# Altium schematic sheet 2.SchDoc
size A3; Author: Sofian Jafar; Engineer: Sofian Jafar; DocumentNumber: 2; Revision: 1.0; SheetNumber: 2; SheetTotal: 3; Descripition: UltraSound BBB Cape; SheetDescription: Band-Pass Filter, Envelope Detector and ADC
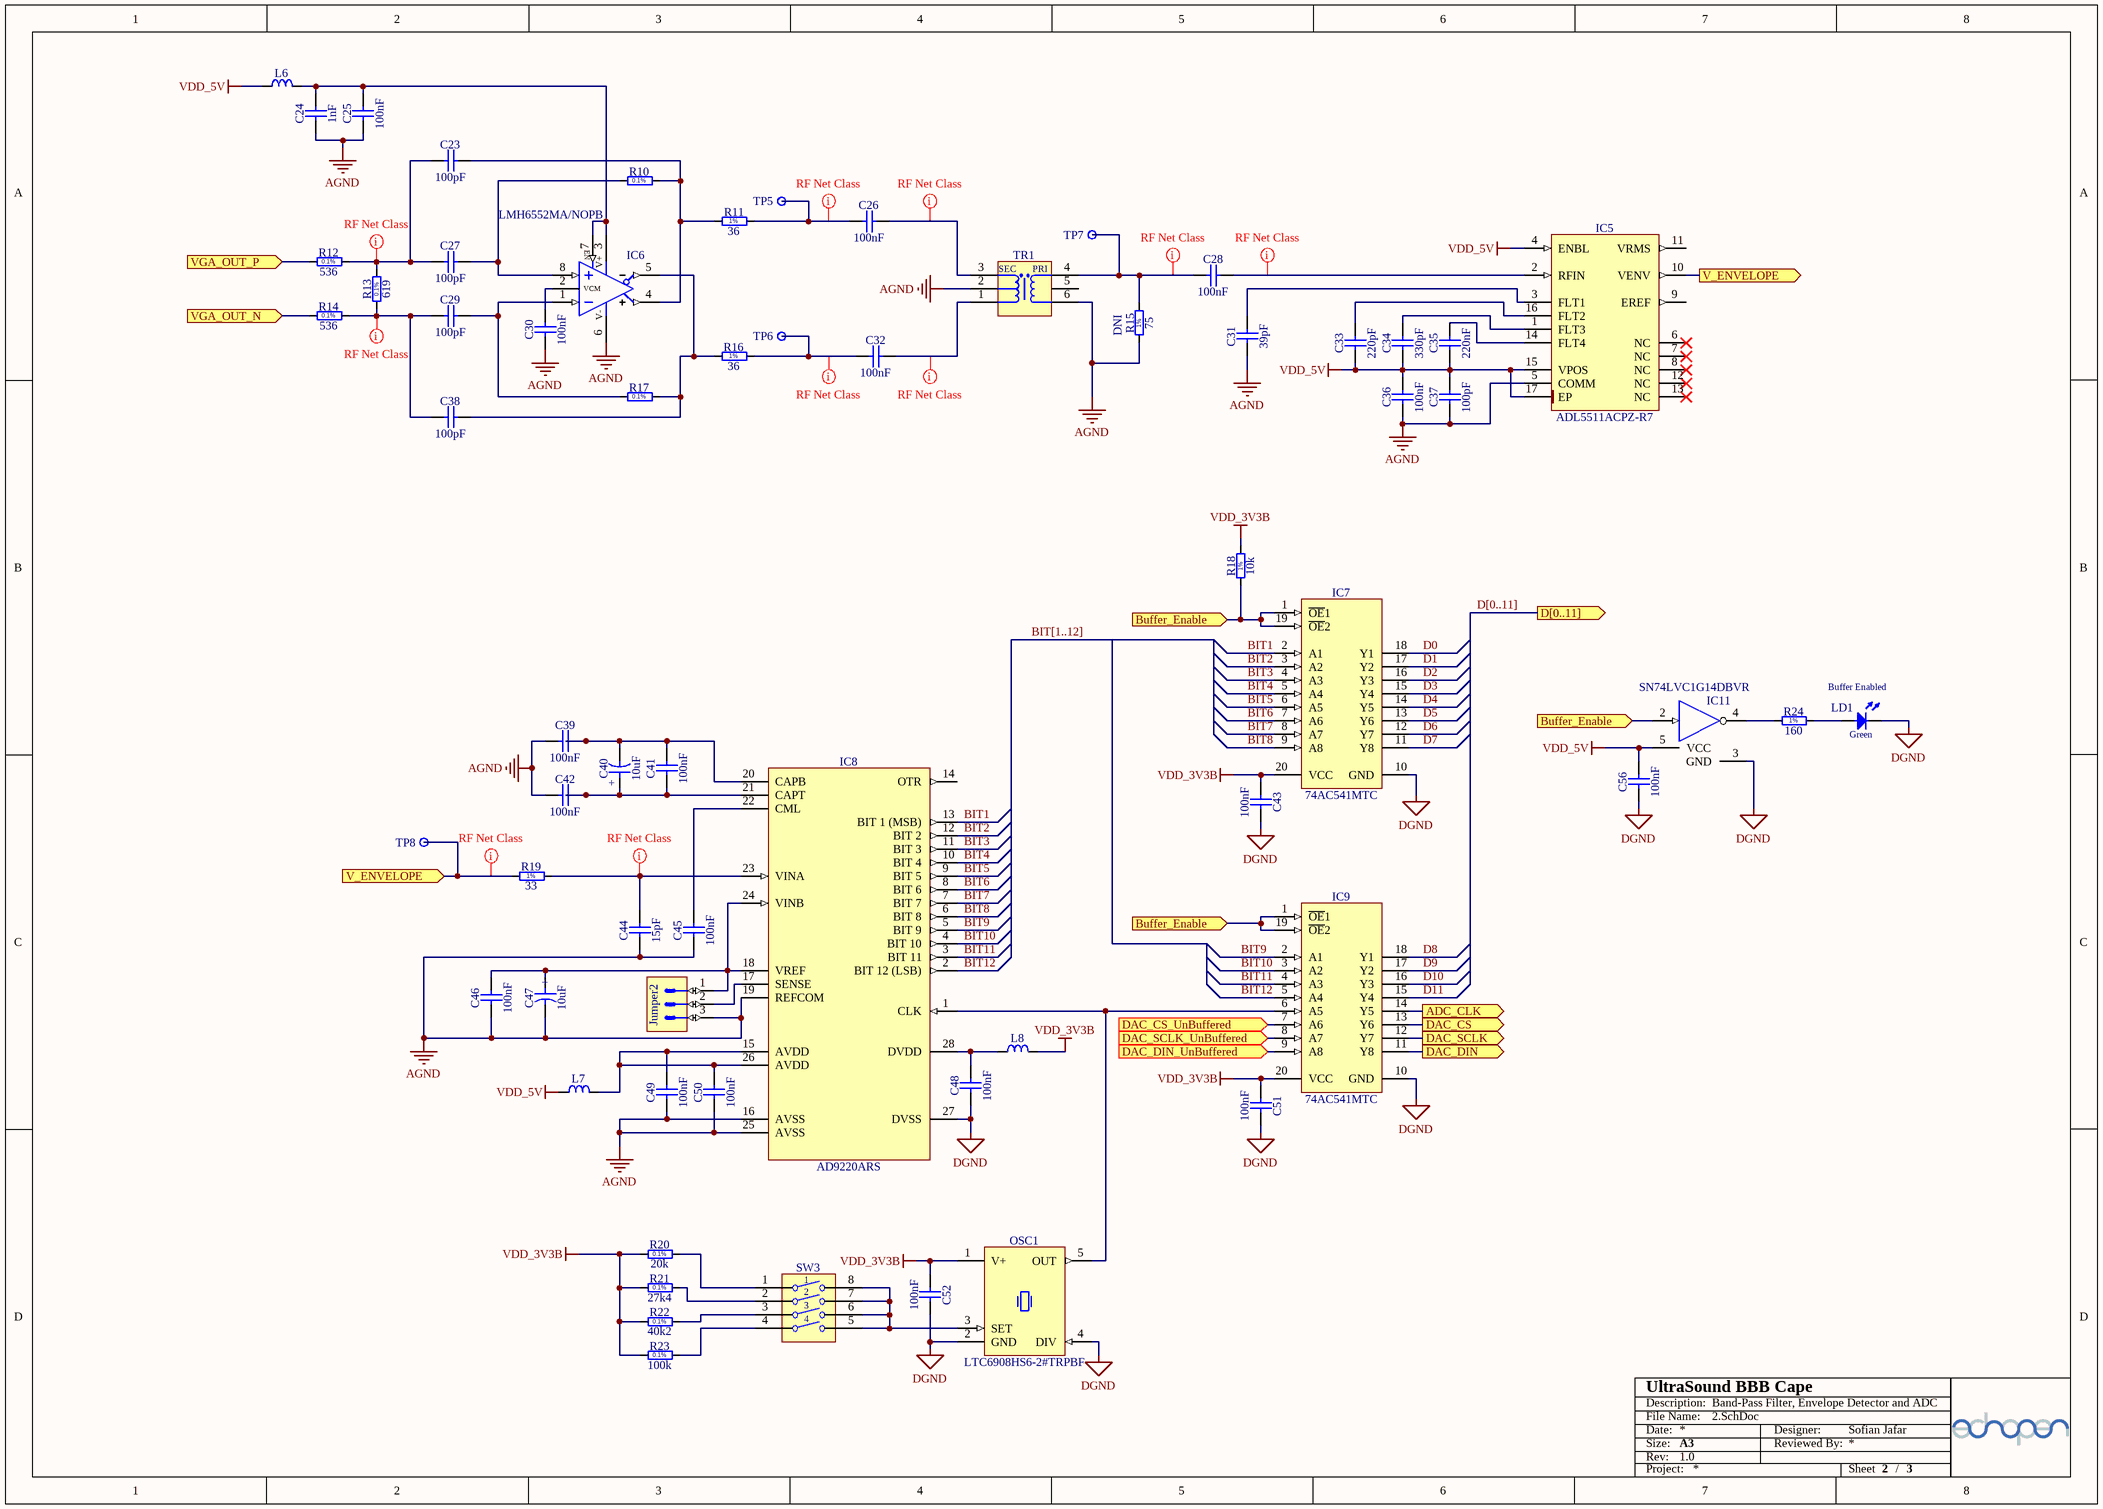
[diagram p0: 2.SchDoc]

## Parts
C23  100pF  [CAPC1608X87N]
C24  1nF  [CAPC1608X87N]
C25  100nF  [CAPC1608X87N]
C26  100nF  [CAPC1608X87N]
C27  100pF  [CAPC1608X87N]
C28  100nF  [CAPC1608X87N]
C29  100pF  [CAPC1608X87N]
C30  100nF  [CAPC1608X87N]
C31  39pF  [CAPC1608X87N]
C32  100nF  [CAPC1608X87N]
C33  220pF  [CAPC1608X87N]
C34  330pF  [CAPC1608X87N]
C35  220nF  [CAPC1608X87N]
C36  100nF  [CAPC1608X87N]
C37  100pF  [CAPC1608X87N]
C38  100pF  [CAPC1608X87N]
C39  100nF  [CAPC1608X87N]
C40  10uF  [CAPMP3528X210N]
C41  100nF  [CAPC1608X87N]
C42  100nF  [CAPC1608X87N]
C43  100nF  [CAPC1608X87N]
C44  15pF  [CAPC1608X87N]
C45  100nF  [CAPC1608X87N]
C46  100nF  [CAPC1608X87N]
C47  10uF  [CAPMP3528X210N]
C48  100nF  [CAPC1608X87N]
C49  100nF  [CAPC1608X87N]
C50  100nF  [CAPC1608X87N]
C51  100nF  [CAPC1608X87N]
C52  100nF  [CAPC1608X87N]
C56  100nF  [CAPC1608X87N]
IC5  ADL5511ACPZ-R7  [QFN50P300X300X80-17N-S175]
IC6  LMH6552MA/NOPB  [SOIC127P600X175-8N]
IC7  74AC541MTC  [SOP65P640X120-20N]
IC8  AD9220ARS  [SOP65P780X200-28N]
IC9  74AC541MTC  [SOP65P640X120-20N]
IC11  SN74LVC1G14DBVR  [SOT95P280X145-5N]
Jumper2  (no value)  [SULLINS_GRPB031VWVN]
L6  75R@100MHz  [INDC2012X105N]  (value not drawn)
L7  75R@100MHz  [INDC2012X105N]  (value not drawn)
L8  75R@100MHz  [INDC2012X105N]  (value not drawn)
LD1  Green  [LED_OSRAM_LGL29K]  (value not drawn)
OSC1  LTC6908HS6-2#TRPBF  [SOT95P280X100-6N]
R10  1k07  [RESC1608X55N]  (value not drawn)
R11  36  [RESC1608X55N]
R12  536  [RESC1608X55N]
R13  619  [RESC1608X55N]
R14  536  [RESC1608X55N]
R15  75  Mounted: DNI  [RESC1608X55N]
R16  36  [RESC1608X55N]
R17  1k07  [RESC1608X55N]  (value not drawn)
R18  10k  [RESC1608X55N]
R19  33  [RESC1608X55N]
R20  20k  [RESC1608X55N]
R21  27k4  [RESC1608X55N]
R22  40k2  [RESC1608X55N]
R23  100k  [RESC1608X55N]
R24  160  [RESC1608X55N]
SW3  Switch  [SW_TYCO_1571983-4]  (value not drawn)
TP5  Test Point  [NICOMATIC_C12000B]  (value not drawn)
TP6  Test Point  [NICOMATIC_C12000B]  (value not drawn)
TP7  Test Point  [NICOMATIC_C12000B]  (value not drawn)
TP8  Test Point  [NICOMATIC_C12000B]  (value not drawn)
TR1  1:1  [XFMR_MINI-CIRCUITS_KK81]  (value not drawn)

## Ports
ADC_CLK (out), Buffer_Enable (in), D[0..11] (out), DAC_CS (out), DAC_CS_UnBuffered (in), DAC_DIN (out), DAC_DIN_UnBuffered (in), DAC_SCLK (out), DAC_SCLK_UnBuffered (in), V_ENVELOPE (in), V_ENVELOPE (out), VGA_OUT_N (in), VGA_OUT_P (in)

## Nets
AGND: C24.1 C25.2 C30.2 C31.1 C36.1 C37.1 C39.1 C42.1 C44.1 C45.2 C46.1 C47.2 C49.1 C50.1 IC5.5(COMM) IC6.6(V-) IC8.16(AVSS) IC8.19(REFCOM) IC8.25(AVSS) Jumper2.3 R15.1 TR1.2(NC) TR1.6(S)
DGND: C43.1 C48.1 C51.1 C52.1 C56.2 IC7.10(GND) IC8.27(DVSS) IC9.10(GND) IC11.3(GND) LD1.1(C) OSC1.2(GND) OSC1.4(DIV)
VDD_3V3B: C43.2 C51.2 C52.2 IC7.20(VCC) IC9.20(VCC) L8.2 OSC1.1(V+) R18.2 R20.1 R21.1 R22.1 R23.1
VDD_5V: C33.1 C34.1 C35.1 C36.2 C37.2 C56.1 IC5.4(ENBL) IC5.15(VPOS) IC5.17(EP) IC11.5(VCC) L6.1 L7.1
ADC_CLK: IC9.14(Y5) ; port ADC_CLK
BIT1: IC7.2(A1) IC8.13(BIT_1_(MSB))
BIT2: IC7.3(A2) IC8.12(BIT_2)
BIT3: IC7.4(A3) IC8.11(BIT_3)
BIT4: IC7.5(A4) IC8.10(BIT_4)
BIT5: IC7.6(A5) IC8.9(BIT_5)
BIT6: IC7.7(A6) IC8.8(BIT_6)
BIT7: IC7.8(A7) IC8.7(BIT_7)
BIT8: IC7.9(A8) IC8.6(BIT_8)
BIT9: IC8.5(BIT_9) IC9.2(A1)
BIT10: IC8.4(BIT_10) IC9.3(A2)
BIT11: IC8.3(BIT_11) IC9.4(A3)
BIT12: IC8.2(BIT_12_(LSB)) IC9.5(A4)
Buffer_Enable: IC7.1(~{OE}1) IC7.19(~{OE}2) IC9.1(~{OE}1) IC9.19(~{OE}2) IC11.2(IN) R18.1 ; port Buffer_Enable
D0: IC7.18(Y1)
D1: IC7.17(Y2)
D2: IC7.16(Y3)
D3: IC7.15(Y4)
D4: IC7.14(Y5)
D5: IC7.13(Y6)
D6: IC7.12(Y7)
D7: IC7.11(Y8)
D8: IC9.18(Y1)
D9: IC9.17(Y2)
D10: IC9.16(Y3)
D11: IC9.15(Y4)
DAC_CS: IC9.13(Y6) ; port DAC_CS
DAC_CS_UnBuffered: IC9.7(A6) ; port DAC_CS_UnBuffered
DAC_DIN: IC9.11(Y8) ; port DAC_DIN
DAC_DIN_UnBuffered: IC9.9(A8) ; port DAC_DIN_UnBuffered
DAC_SCLK: IC9.12(Y7) ; port DAC_SCLK
DAC_SCLK_UnBuffered: IC9.8(A7) ; port DAC_SCLK_UnBuffered
V_ENVELOPE: IC5.10(VENV) R19.1 TP8.1 ; port V_ENVELOPE
VGA_OUT_N: R14.1 ; port VGA_OUT_N
VGA_OUT_P: R12.1 ; port VGA_OUT_P
NetC23_1: C23.1 C27.1 R12.2 R13.2
NetC23_2: C23.2 IC6.4(VOUT+) R10.2 R11.1
NetC24_2: C24.2 C25.1 IC6.3(V+) IC6.7(EN) L6.2
NetC26_1: C26.1 TR1.3(PDOT)
NetC26_2: C26.2 R11.2 TP5.1
NetC27_2: C27.2 IC6.8(IN+) R10.1
NetC28_1: C28.1 R15.2 TP7.1 TR1.4(SDOT)
NetC28_2: C28.2 IC5.2(RFIN)
NetC29_1: C29.1 C38.1 R13.1 R14.2
NetC29_2: C29.2 IC6.1(IN-) R17.1
NetC30_1: C30.1 IC6.2(VOCM)
NetC31_2: C31.2 IC5.3(FLT1)
NetC32_1: C32.1 TR1.1(P)
NetC32_2: C32.2 R16.2 TP6.1
NetC33_2: C33.2 IC5.16(FLT2)
NetC34_2: C34.2 IC5.1(FLT3)
NetC35_2: C35.2 IC5.14(FLT4)
NetC38_2: C38.2 IC6.5(VOUT-) R16.1 R17.2
NetC39_2: C39.2 C40.2 C41.2 IC8.20(CAPB)
NetC40_1: C40.1 C41.1 C42.2 IC8.21(CAPT)
NetC44_2: C44.2 IC8.23(VINA) R19.2
NetC45_1: C45.1 IC8.22(CML)
NetC46_2: C46.2 C47.1 IC8.18(VREF) IC8.24(VINB) Jumper2.1
NetC48_2: C48.2 IC8.28(DVDD) L8.1
NetC49_2: C49.2 C50.2 IC8.15(AVDD) IC8.26(AVDD) L7.2
NetIC8_1: IC8.1(CLK) IC9.6(A5) OSC1.5(OUT)
NetIC8_17: IC8.17(SENSE) Jumper2.2
NetIC11_4: IC11.4(OUT) R24.1
NetLD1_2: LD1.2(A) R24.2
NetOSC1_3: OSC1.3(SET) SW3.5 SW3.6 SW3.7 SW3.8
NetR20_2: R20.2 SW3.1
NetR21_2: R21.2 SW3.2
NetR22_2: R22.2 SW3.3
NetR23_2: R23.2 SW3.4

Not connected (* = marked no-connect by the designer): IC5 6(NC)* 7(NC)* 8(NC)* 9(EREF) 11(VRMS) 12(NC)* 13(NC)*; IC8 14(OTR); TR1 5(NC)

## Buses and harness runs
bus BIT[1..12]
bus D[0..11] = port D[0..11]

## Layout directives
net class RF: NetC23_1, NetC26_1, NetC26_2, NetC28_1, NetC28_2, NetC29_1, NetC32_1, NetC32_2, NetC44_2, V_ENVELOPE

## Notes on the sheet
- Buffer Enabled
- File Name:
- Date:
- Rev:
- Description:
- Size:
- A3
- Designer:
- Reviewed By:
- Project:
- Sheet
- /
- (in symbol CTE3528-21_10UF_16V_20%_SANYO_TQC) +
- (in symbol LMH6552MA/NOPB) VCM
- (in symbol R0603_1K07_0.1%_0.063W_10PPM) 0.1%
- (in symbol R0603_10K_1%_0.1W_100PPM) 1%
- (in symbol R0603_20K_0.1%_0.063W_10PPM) 0.1%
- (in symbol R0603_27K4_0.1%_0.063W_10PPM) 0.1%
- (in symbol R0603_33R_1%_0.1W_100PPM) 1%
- (in symbol R0603_36R_1%_0.1W_100PPM) 1%
- (in symbol R0603_40K2_0.1%_0.063W_10PPM) 0.1%
- (in symbol R0603_75R_1%_0.1W_100PPM) 1%
- (in symbol R0603_100K_0.1%_0.063W_10PPM) 0.1%
- (in symbol R0603_160R_1%_0.1W_100PPM) 1%
- (in symbol R0603_536R_0.1%_0.063W_10PPM) 0.1%
- (in symbol R0603_619R_0.1%_0.063W_10PPM) 0.1%
- (in symbol XFMR_MINI-CIRCUITS_T1-6T-KK81) SEC; PRI

## Library data of the parts
C23 C27 C29 C37 C38 = CC0603_100PF_50V_5%_NP0: Non-polarised capacitor; Part Description: SMD Multilayer Chip Ceramic Capacitor; Manufacturer: GENERIC; Manufacturer1 Part Number: 223886715101; Voltage: 50V; TC: NP0; Tolerance: ±5%; Table: Capacitors SMD; Part Number: CC0603_100PF_50V_5%_NP0; Component Kind: Standard; Component Type: Standard; Pin Count: 2; Value: 100pF; Status: Preferred; Manufacturer Part Number: CC0603_100PF_50V_5%_NP0; Case: 0603; Mounted: Yes; Socket: No; SMD: Yes; Manufacturer1 Example: PHYCOMP; Manufacturer1 ComponentHeight: 0.87mm; HelpURL: \\cern.ch\dfs\Applications\Altium\Datasheets\CC0603_NP0_PHYCOMP.pdf; Author: CERN DEM JLC; CreateDate: 12/3/2007; LatestRevisionDate: 12/3/2007
C24 = CC0603_1NF_50V_10%_X7R: Non-polarised capacitor; Part Description: SMD Multilayer Chip Ceramic Capacitor; Manufacturer: GENERIC; Manufacturer1 Part Number: 223858615623; Voltage: 50V; TC: X7R; Tolerance: ±10%; Table: Capacitors SMD; Part Number: CC0603_1NF_50V_10%_X7R; Component Kind: Standard; Component Type: Standard; Pin Count: 2; Value: 1nF; Status: Preferred; Manufacturer Part Number: CC0603_1NF_50V_10%_X7R; Case: 0603; Mounted: Yes; Socket: No; SMD: Yes; Manufacturer1 Example: PHYCOMP; Manufacturer1 ComponentHeight: 0.87mm; HelpURL: \\cern.ch\dfs\Applications\Altium\Datasheets\CC0603_X7R_PHYCOMP.pdf; Author: CERN DEM JLC; CreateDate: 12/3/2007; LatestRevisionDate: 12/3/2007
C25 C26 C28 C30 C32 C36 C39 C41-C43 C45 C46 C48-C52 C56 = CC0603_100NF_50V_10%_X7R: Non-polarised capacitor; Part Description: SMD Multilayer Chip Ceramic Capacitor; Manufacturer: GENERIC; Manufacturer1 Part Number: 223858615649; Voltage: 50V; TC: X7R; Tolerance: ±10%; Table: Capacitors SMD; Part Number: CC0603_100NF_50V_10%_X7R; Component Kind: Standard; Component Type: Standard; Pin Count: 2; Value: 100nF; Status: Preferred; Manufacturer Part Number: CC0603_100NF_50V_10%_X7R; Case: 0603; Mounted: Yes; Socket: No; SMD: Yes; Manufacturer1 Example: PHYCOMP; Manufacturer1 ComponentHeight: 0.87mm; HelpURL: \\cern.ch\dfs\Applications\Altium\Datasheets\CC0603_X7R_PHYCOMP.pdf; Author: CERN DEM JLC; CreateDate: 12/3/2007; LatestRevisionDate: 12/3/2007
C31 = CC0603_39PF_50V_5%_NP0: Non-polarised capacitor; Part Description: SMD Multilayer Chip Ceramic Capacitor; Manufacturer: GENERIC; Manufacturer1 Part Number: 223886715399; Voltage: 50V; TC: NP0; Tolerance: ±5%; Table: Capacitors SMD; Part Number: CC0603_39PF_50V_5%_NP0; Component Kind: Standard; Component Type: Standard; Pin Count: 2; Value: 39pF; Status: Preferred; Manufacturer Part Number: CC0603_39PF_50V_5%_NP0; Case: 0603; Mounted: Yes; Socket: No; SMD: Yes; Manufacturer1 Example: PHYCOMP; Manufacturer1 ComponentHeight: 0.87mm; HelpURL: \\cern.ch\dfs\Applications\Altium\Datasheets\CC0603_NP0_PHYCOMP.pdf; Author: CERN DEM JLC; CreateDate: 12/3/2007; LatestRevisionDate: 12/3/2007
C33 = CC0603_220PF_50V_5%_NP0: Non-polarised capacitor; Part Description: SMD Multilayer Chip Ceramic Capacitor; Manufacturer: GENERIC; Manufacturer1 Part Number: 223886715221; Voltage: 50V; TC: NP0; Tolerance: ±5%; Table: Capacitors SMD; Part Number: CC0603_220PF_50V_5%_NP0; Component Kind: Standard; Component Type: Standard; Pin Count: 2; Value: 220pF; Status: Preferred; Manufacturer Part Number: CC0603_220PF_50V_5%_NP0; Case: 0603; Mounted: Yes; Socket: No; SMD: Yes; Manufacturer1 Example: PHYCOMP; Manufacturer1 ComponentHeight: 0.87mm; HelpURL: \\cern.ch\dfs\Applications\Altium\Datasheets\CC0603_NP0_PHYCOMP.pdf; Author: CERN DEM JLC; CreateDate: 12/3/2007; LatestRevisionDate: 12/3/2007
C34 = CC0603_330PF_50V_5%_NP0: Non-polarised capacitor; Part Description: SMD Multilayer Chip Ceramic Capacitor; Manufacturer: GENERIC; Manufacturer1 Part Number: 223886715331; Voltage: 50V; TC: NP0; Tolerance: ±5%; Table: Capacitors SMD; Part Number: CC0603_330PF_50V_5%_NP0; Component Kind: Standard; Component Type: Standard; Pin Count: 2; Value: 330pF; Status: Preferred; Manufacturer Part Number: CC0603_330PF_50V_5%_NP0; Case: 0603; Mounted: Yes; Socket: No; SMD: Yes; Manufacturer1 Example: PHYCOMP; Manufacturer1 ComponentHeight: 0.87mm; HelpURL: \\cern.ch\dfs\Applications\Altium\Datasheets\CC0603_NP0_PHYCOMP.pdf; Author: CERN DEM JLC; CreateDate: 12/3/2007; LatestRevisionDate: 12/3/2007
C35 = CC0603_220NF_10V_10%_X7R: Non-polarised capacitor; Part Description: SMD Multilayer Chip Ceramic Capacitor; Manufacturer: GENERIC; Manufacturer1 Part Number: 223824615654 or CC0603KRX7R6BB224; Voltage: 10V; TC: X7R; Tolerance: ±10%; Table: Capacitors SMD; Part Number: CC0603_220NF_10V_10%_X7R; Component Kind: Standard; Component Type: Standard; Pin Count: 2; Value: 220nF; Status: Preferred; Manufacturer Part Number: CC0603_220NF_10V_10%_X7R; Case: 0603; Mounted: Yes; Socket: No; SMD: Yes; Manufacturer1 Example: YAGEO PHYCOMP; Manufacturer1 ComponentHeight: 0.9mm; HelpURL: \\cern.ch\dfs\Applications\Altium\Datasheets\CC0603_X7R_PHYCOMP.pdf; Author: CERN DEM JLC; CreateDate: 10/25/2012; LatestRevisionDate: 10/25/2012
C40 C47 = CTE3528-21_10UF_16V_20%_SANYO_TQC: Polarised capacitor; Part Description: ESR 0R1 Solid Tantalum Chip Capacitor; Manufacturer: SANYO; Manufacturer Part Number: 16TQC10M; Voltage: 16V; Tolerance: ±20%; Table: Capacitors SMD; Part Number: CTE3528-21_10UF_16V_20%_SANYO_TQC; Component Kind: Standard; Component Type: Standard; Pin Count: 2; Value: 10uF; Status: None; Case: B; Mounted: Yes; Socket: No; SMD: Yes; ComponentHeight: 2.1mm; HelpURL: \\cern.ch\dfs\Applications\Altium\Datasheets\CTE_SANYO_TQC.pdf; Author: CERN DEM JLC; CreateDate: 6/29/2011; LatestRevisionDate: 6/29/2011
C44 = CC0603_15PF_50V_5%_NP0: Non-polarised capacitor; Part Description: SMD Multilayer Chip Ceramic Capacitor; Manufacturer: GENERIC; Manufacturer1 Part Number: 223886715159; Voltage: 50V; TC: NP0; Tolerance: ±5%; Table: Capacitors SMD; Part Number: CC0603_15PF_50V_5%_NP0; Component Kind: Standard; Component Type: Standard; Pin Count: 2; Value: 15pF; Status: Preferred; Manufacturer Part Number: CC0603_15PF_50V_5%_NP0; Case: 0603; Mounted: Yes; Socket: No; SMD: Yes; Manufacturer1 Example: PHYCOMP; Manufacturer1 ComponentHeight: 0.87mm; HelpURL: \\cern.ch\dfs\Applications\Altium\Datasheets\CC0603_NP0_PHYCOMP.pdf; Author: CERN DEM JLC; CreateDate: 12/3/2007; LatestRevisionDate: 12/3/2007
IC5 = ADL5511ACPZ-R7: DC to 6 GHz Envelope and TruPwr RMS Detector; Manufacturer: ANALOG DEVICES; Table: Analog & Interface; Part Number: ADL5511ACPZ-R7; Component Kind: Standard; Component Type: Standard; Device: ADL5511ACPZ-R7; PackageDescription: QFN, 0.50mm Pitch, Square; 16 Pin, 3.00mm L X 3.00mm W X 0.80mm H Body (w/Thermal Tab 1.75 X 1.75mm),  IPC Medium Density; Part Description: DC to 6 GHz Envelope and TruPwr RMS Detector; Manufacturer Part Number: ADL5511ACPZ-R7; Pin Count: 17; Case: QFN16; Mounted: Yes; Socket: No; SMD: Yes; ComponentHeight: 0.8mm; Author: CERN DEM JLC; HelpURL: \\cern.ch\dfs\Applications\Altium\Datasheets\ADL5511ACPZ-R7.pdf; CreateDate: 11/15/2012; LatestRevisionDate: 11/15/2012
IC6 = LMH6552MA/NOPB: 1.5 GHz Fully Differential Amplifier; Manufacturer: TEXAS INSTRUMENTS; Table: Operational Amplifiers; Part Number: LMH6552MA/NOPB; Component Kind: Standard; Component Type: Standard; Device: LMH6552MA/NOPB; PackageDescription: SOIC 8, Pitch 1.27mm - Body 4x5mm, IPC Medium Density; Part Description: 1.5 GHz Fully Differential Amplifier; Manufacturer Part Number: LMH6552MA/NOPB; Pin Count: 8; Case: SOIC8; Mounted: Yes; Socket: No; SMD: Yes; ComponentHeight: 1.75mm; Author: CERN DEM JLC; HelpURL: \\cern.ch\dfs\Applications\Altium\Datasheets\LMH6552MA-NOPB.pdf; CreateDate: 5/13/2013; LatestRevisionDate: 5/13/2013
IC7 IC9 = 74AC541MTC: Octal Buffer/Line Driver with 3-State Outputs; Manufacturer: FAIRCHILD; Table: Standard Logic; Part Number: 74AC541MTC; Component Kind: Standard; Component Type: Standard; Device: 74AC541MTC; PackageDescription: SOP, 20-Leads, Body 6.5x4.4mm, Pitch 0.65mm, IPC Medium Density; Part Description: Octal Buffer/Line Driver with 3-State Outputs; Manufacturer Part Number: 74AC541MTC; Pin Count: 20; Case: TSSOP20; Mounted: Yes; Socket: No; SMD: Yes; ComponentHeight: 1.2mm; Author: CERN DEM JLC; HelpURL: \\cern.ch\dfs\Applications\Altium\Datasheets\74AC541MTC.pdf; CreateDate: 7/6/2010; LatestRevisionDate: 7/6/2010
IC8 = AD9220ARS: 12-Bit, 10MSPS Sampling Analog-To-Digital Converter; Part Description: 10MSPS 12bit ADC; Manufacturer: ANALOG DEVICES; Table: Analog & Interface; Part Number: AD9220ARS; Component Kind: Standard; Component Type: Standard; Device: AD9220ARS; PackageDescription: SOP, 0.65mm Pitch; 28 pin, 5.30mm W X 10.20mm L X 2.00mm H body, IPC Medium Density; Manufacturer Part Number: AD9220ARS; Pin Count: 28; Case: SSOP28; Mounted: Yes; Socket: No; SMD: Yes; ComponentHeight: 2mm; Author: S. Jafar; CreateDate: 12/20/2015; LatestRevisionDate: 1/6/2016
IC11 = SN74LVC1G14DBVR: Single Schmitt-Trigger Inverter; Manufacturer: TEXAS INSTRUMENTS; Table: Standard Logic; Part Number: SN74LVC1G14DBVR; Component Kind: Standard; Component Type: Standard; Device: SN74LVC1G14DBVR; PackageDescription: SOT, 0.95mm pitch; 5 pin, 1.60mm W X 2.90mm L X 1.45mm H body, IPC Medium Density; Part Description: Single Schmitt-Trigger Inverter; Manufacturer Part Number: SN74LVC1G14DBVR; Pin Count: 5; Case: SOT23-5; Mounted: Yes; Socket: No; SMD: Yes; ComponentHeight: 1.45mm; Author: CERN DEM JLC; HelpURL: \\cern.ch\dfs\Applications\Altium\Datasheets\SN74LVC1G14DBVR.pdf; CreateDate: 7/4/2012; LatestRevisionDate: 7/4/2012
Jumper2 = SULLINS_GRPB031VWVN: Connector 3 Male; Part Description: 3 Contact 0.5" Pitch Single-In-Line Vertical Header; Table: Miscellaneous; Part Number: SULLINS_GRPB031VWVN; Component Kind: Standard; Component Type: Standard; Pin Count: 3; Mounted: Yes; Socket: No; SMD: No; Status: None; Manufacturer: SULLINS; Manufacturer Part Number: GRPB031VWVN; ComponentHeight: 4mm; Author: S. Jafar; CreateDate: 12/29/2015; LatestRevisionDate: 12/29/2015
L6-L8 = IND0805_MURATA_BLM21BB750SN1D: Inductor; Part Description: SMD EMIFIL Suppression Chip Ferrite Bead; Manufacturer: MURATA; Power: 700mA; Resistance: 0.16R; Tolerance: ±25%; Table: Inductors SMD; Part Number: IND0805_MURATA_BLM21BB750SN1D; Component Kind: Standard; Component Type: Standard; Pin Count: 2; Value: 75R@100MHz; Status: None; Manufacturer Part Number: BLM21BB750SN1D; Case: 0805; Mounted: Yes; Socket: No; SMD: Yes; ComponentHeight: 1.05mm; Author: S. Jafar; CreateDate: 12/21/2015; LatestRevisionDate: 12/21/2015
LD1 = LED_OSRAM_LG L29K-G2J1-24-Z: LED Green 1C 2A; Part Description: Surface Mount Green LED (0603 Case); Manufacturer: OSRAM; Table: LEDs & Displays; Part Number: LED_OSRAM_LG L29K-G2J1-24-Z; Component Kind: Standard; Component Type: Standard; Color: Green; PackageDescription: Green Chip LED, 2-Leads, Body 1.7x0.8mm, IPC Medium Density; Manufacturer Part Number: LG L29K-G2J1-24-Z; Pin Count: 2; Case: 0603; Mounted: Yes; Socket: No; SMD: Yes; ComponentHeight: 0.67mm; HelpURL: \\cern.ch\dfs\Applications\Altium\Datasheets\LED_OSRAM_LGL29K.pdf; Author: CERN DEM JLC; CreateDate: 4/24/2012; LatestRevisionDate: 4/24/2012
OSC1 = LTC6900CS5: Resistor Set SOT-23 Oscillator 1kHz-20MHz; Part Description: 1kHz to 20MHz Resistor Set SOT-23 Oscillator; Manufacturer: LINEAR TECHNOLOGY; Table: Crystals & Oscillators; Part Number: LTC6900CS5; Component Kind: Standard; Component Type: Standard; Device: LTC6908HS6-2#TRPBF; PackageDescription: SOT23, 0.95mm pitch; 6 pin, 1.625mm W X 2.90mm L X 1.00mm H body, IPC Medium Density; Manufacturer Part Number: LTC6900CS5; Pin Count: 5; Case: SOT23; Mounted: Yes; Socket: No; SMD: Yes; ComponentHeight: 1mm; Author: S.Jafar; CreateDate: 12/22/2015; LatestRevisionDate: 12/22/2015
R10 R17 = R0603_1K07_0.1%_0.063W_10PPM: Resistor - 0.1%; Part Description: Thin Film Chip Resistor; Manufacturer: GENERIC; Manufacturer1 Part Number: RN73C1J1K07BTDF; Power: 0.063W; TC: ±10ppm; Table: Resistors SMD; Part Number: R0603_1K07_0.1%_0.063W_10PPM; Component Kind: Standard; Component Type: Standard; Pin Count: 2; Value: 1k07; Status: Not recommended; Tolerance: ±0.1%; Manufacturer Part Number: R0603_1K07_0.1%_0.063W_10PPM; Case: 0603; Mounted: Yes; Socket: No; SMD: Yes; Manufacturer1 Example: TYCO HOLSWORTHY; Manufacturer1 ComponentHeight: 0.5mm; HelpURL: \\cern.ch\dfs\Applications\Altium\Datasheets\R0603_Tyco_RN73.pdf; Author: CERN DEM JLC; CreateDate: 12/3/2007; LatestRevisionDate: 3/13/2008
R11 R16 = R0603_36R_1%_0.1W_100PPM: Resistor - 1%; Part Description: General Purpose Thick Film Chip Resistor; Manufacturer: GENERIC; Manufacturer1 Part Number: NRC06F36R0TRF; Power: 0.1W; TC: ±100ppm/°C; Table: Resistors SMD; Part Number: R0603_36R_1%_0.1W_100PPM; Component Kind: Standard; Component Type: Standard; Pin Count: 2; Value: 36; Status: Preferred; Tolerance: ±1%; Manufacturer Part Number: R0603_36R_1%_0.1W_100PPM; Case: 0603; Mounted: Yes; Socket: No; SMD: Yes; Manufacturer1 Example: NIC COMPONENT; Manufacturer1 ComponentHeight: 0.55mm; HelpURL: \\cern.ch\dfs\Applications\Altium\Datasheets\R0603_NIC_NRC.pdf; Author: CERN DEM JLC; CreateDate: 12/3/2007; LatestRevisionDate: 3/13/2008
R12 R14 = R0603_536R_0.1%_0.063W_10PPM: Resistor - 0.1%; Part Description: Thin Film Chip Resistor; Manufacturer: GENERIC; Manufacturer1 Part Number: RN73C1J536RBTDF; Power: 0.063W; TC: ±10ppm; Table: Resistors SMD; Part Number: R0603_536R_0.1%_0.063W_10PPM; Component Kind: Standard; Component Type: Standard; Pin Count: 2; Value: 536; Status: Not recommended; Tolerance: ±0.1%; Manufacturer Part Number: R0603_536R_0.1%_0.063W_10PPM; Case: 0603; Mounted: Yes; Socket: No; SMD: Yes; Manufacturer1 Example: TYCO HOLSWORTHY; Manufacturer1 ComponentHeight: 0.5mm; HelpURL: \\cern.ch\dfs\Applications\Altium\Datasheets\R0603_Tyco_RN73.pdf; Author: CERN DEM JLC; CreateDate: 12/3/2007; LatestRevisionDate: 3/13/2008
R13 = R0603_619R_0.1%_0.063W_10PPM: Resistor - 0.1%; Part Description: Thin Film Chip Resistor; Manufacturer: GENERIC; Manufacturer1 Part Number: RN73C1J619RBTDF; Power: 0.063W; TC: ±10ppm; Table: Resistors SMD; Part Number: R0603_619R_0.1%_0.063W_10PPM; Component Kind: Standard; Component Type: Standard; Pin Count: 2; Value: 619; Status: Not recommended; Tolerance: ±0.1%; Manufacturer Part Number: R0603_619R_0.1%_0.063W_10PPM; Case: 0603; Mounted: Yes; Socket: No; SMD: Yes; Manufacturer1 Example: TYCO HOLSWORTHY; Manufacturer1 ComponentHeight: 0.5mm; HelpURL: \\cern.ch\dfs\Applications\Altium\Datasheets\R0603_Tyco_RN73.pdf; Author: CERN DEM JLC; CreateDate: 12/3/2007; LatestRevisionDate: 3/13/2008
R15 = R0603_75R_1%_0.1W_100PPM: Resistor - 1%; Part Description: General Purpose Thick Film Chip Resistor; Manufacturer: GENERIC; Manufacturer1 Part Number: NRC06F75R0TRF; Power: 0.1W; TC: ±100ppm/°C; Table: Resistors SMD; Part Number: R0603_75R_1%_0.1W_100PPM; Component Kind: Standard; Component Type: Standard; Pin Count: 2; Value: 75; Status: Preferred; Tolerance: ±1%; Manufacturer Part Number: R0603_75R_1%_0.1W_100PPM; Case: 0603; Socket: No; SMD: Yes; Manufacturer1 Example: NIC COMPONENT; Manufacturer1 ComponentHeight: 0.55mm; HelpURL: \\cern.ch\dfs\Applications\Altium\Datasheets\R0603_NIC_NRC.pdf; Author: CERN DEM JLC; CreateDate: 12/3/2007; LatestRevisionDate: 3/13/2008
R18 = R0603_10K_1%_0.1W_100PPM: Resistor - 1%; Part Description: General Purpose Thick Film Chip Resistor; Manufacturer: GENERIC; Manufacturer1 Part Number: NRC06F1002TRF; Power: 0.1W; TC: ±100ppm/°C; Table: Resistors SMD; Part Number: R0603_10K_1%_0.1W_100PPM; Component Kind: Standard; Component Type: Standard; Pin Count: 2; Value: 10k; Status: Preferred; Tolerance: ±1%; Manufacturer Part Number: R0603_10K_1%_0.1W_100PPM; Case: 0603; Mounted: Yes; Socket: No; SMD: Yes; Manufacturer1 Example: NIC COMPONENT; Manufacturer1 ComponentHeight: 0.55mm; HelpURL: \\cern.ch\dfs\Applications\Altium\Datasheets\R0603_NIC_NRC.pdf; Author: CERN DEM JLC; CreateDate: 12/3/2007; LatestRevisionDate: 3/13/2008
R19 = R0603_33R_1%_0.1W_100PPM: Resistor - 1%; Part Description: General Purpose Thick Film Chip Resistor; Manufacturer: GENERIC; Manufacturer1 Part Number: NRC06F33R0TRF; Power: 0.1W; TC: ±100ppm/°C; Table: Resistors SMD; Part Number: R0603_33R_1%_0.1W_100PPM; Component Kind: Standard; Component Type: Standard; Pin Count: 2; Value: 33; Status: Preferred; Tolerance: ±1%; Manufacturer Part Number: R0603_33R_1%_0.1W_100PPM; Case: 0603; Mounted: Yes; Socket: No; SMD: Yes; Manufacturer1 Example: NIC COMPONENT; Manufacturer1 ComponentHeight: 0.55mm; HelpURL: \\cern.ch\dfs\Applications\Altium\Datasheets\R0603_NIC_NRC.pdf; Author: CERN DEM JLC; CreateDate: 12/3/2007; LatestRevisionDate: 3/13/2008
R20 = R0603_20K_0.1%_0.063W_10PPM: Resistor - 0.1%; Part Description: Thin Film Chip Resistor; Manufacturer: GENERIC; Manufacturer1 Part Number: RN73C1J20KBTDF; Power: 0.063W; TC: ±10ppm; Table: Resistors SMD; Part Number: R0603_20K_0.1%_0.063W_10PPM; Component Kind: Standard; Component Type: Standard; Pin Count: 2; Value: 20k; Status: Not recommended; Tolerance: ±0.1%; Manufacturer Part Number: R0603_20K_0.1%_0.063W_10PPM; Case: 0603; Mounted: Yes; Socket: No; SMD: Yes; Manufacturer1 Example: TYCO HOLSWORTHY; Manufacturer1 ComponentHeight: 0.5mm; HelpURL: \\cern.ch\dfs\Applications\Altium\Datasheets\R0603_Tyco_RN73.pdf; Author: CERN DEM JLC; CreateDate: 12/3/2007; LatestRevisionDate: 3/13/2008
R21 = R0603_27K4_0.1%_0.063W_10PPM: Resistor - 0.1%; Part Description: Thin Film Chip Resistor; Manufacturer: GENERIC; Manufacturer1 Part Number: RN73C1J27K4BTDF; Power: 0.063W; TC: ±10ppm; Table: Resistors SMD; Part Number: R0603_27K4_0.1%_0.063W_10PPM; Component Kind: Standard; Component Type: Standard; Pin Count: 2; Value: 27k4; Status: Not recommended; Tolerance: ±0.1%; Manufacturer Part Number: R0603_27K4_0.1%_0.063W_10PPM; Case: 0603; Mounted: Yes; Socket: No; SMD: Yes; Manufacturer1 Example: TYCO HOLSWORTHY; Manufacturer1 ComponentHeight: 0.5mm; HelpURL: \\cern.ch\dfs\Applications\Altium\Datasheets\R0603_Tyco_RN73.pdf; Author: CERN DEM JLC; CreateDate: 12/3/2007; LatestRevisionDate: 3/13/2008
R22 = R0603_40K2_0.1%_0.063W_10PPM: Resistor - 0.1%; Part Description: Thin Film Chip Resistor; Manufacturer: GENERIC; Manufacturer1 Part Number: RN73C1J40K2BTDF; Power: 0.063W; TC: ±10ppm; Table: Resistors SMD; Part Number: R0603_40K2_0.1%_0.063W_10PPM; Component Kind: Standard; Component Type: Standard; Pin Count: 2; Value: 40k2; Status: Not recommended; Tolerance: ±0.1%; Manufacturer Part Number: R0603_40K2_0.1%_0.063W_10PPM; Case: 0603; Mounted: Yes; Socket: No; SMD: Yes; Manufacturer1 Example: TYCO HOLSWORTHY; Manufacturer1 ComponentHeight: 0.5mm; HelpURL: \\cern.ch\dfs\Applications\Altium\Datasheets\R0603_Tyco_RN73.pdf; Author: CERN DEM JLC; CreateDate: 12/3/2007; LatestRevisionDate: 3/13/2008
R23 = R0603_100K_0.1%_0.063W_10PPM: Resistor - 0.1%; Part Description: Thin Film Chip Resistor; Manufacturer: GENERIC; Manufacturer1 Part Number: RN73C1J100KBTDF; Power: 0.063W; TC: ±10ppm; Table: Resistors SMD; Part Number: R0603_100K_0.1%_0.063W_10PPM; Component Kind: Standard; Component Type: Standard; Pin Count: 2; Value: 100k; Status: Not recommended; Tolerance: ±0.1%; Manufacturer Part Number: R0603_100K_0.1%_0.063W_10PPM; Case: 0603; Mounted: Yes; Socket: No; SMD: Yes; Manufacturer1 Example: TYCO HOLSWORTHY; Manufacturer1 ComponentHeight: 0.5mm; HelpURL: \\cern.ch\dfs\Applications\Altium\Datasheets\R0603_Tyco_RN73.pdf; Author: CERN DEM JLC; CreateDate: 12/3/2007; LatestRevisionDate: 3/13/2008
R24 = R0603_160R_1%_0.1W_100PPM: Resistor - 1%; Part Description: General Purpose Thick Film Chip Resistor; Manufacturer: GENERIC; Manufacturer1 Part Number: NRC06F1600TRF; Power: 0.1W; TC: ±100ppm/°C; Table: Resistors SMD; Part Number: R0603_160R_1%_0.1W_100PPM; Component Kind: Standard; Component Type: Standard; Pin Count: 2; Value: 160; Status: Preferred; Tolerance: ±1%; Manufacturer Part Number: R0603_160R_1%_0.1W_100PPM; Case: 0603; Mounted: Yes; Socket: No; SMD: Yes; Manufacturer1 Example: NIC COMPONENT; Manufacturer1 ComponentHeight: 0.55mm; HelpURL: \\cern.ch\dfs\Applications\Altium\Datasheets\R0603_NIC_NRC.pdf; Author: CERN DEM JLC; CreateDate: 12/3/2007; LatestRevisionDate: 3/13/2008
SW3 = SW_TYCO_1571983-4: 4 Ways SPST DIP Switch; Part Description: 4 Way SPST SMD DIP Switch, Latched, Contact Rating 0.025A 24VDC; Manufacturer: TYCO; Manufacturer Part Number: 1571983-4 or GDH04S04; Table: Switches; Part Number: SW_TYCO_1571983-4; Component Kind: Standard; Component Type: Standard; Pin Count: 8; PackageDescription: Pitch 1.27mm,  Body 6.2x6.2mm, 4 Ways SPST Surface-Mount DIP Switch, TYCO GDH Serie; Family: Switch; Mounted: Yes; Socket: No; SMD: Yes; Status: None; ComponentHeight: 2.31mm; HelpURL: \\cern.ch\dfs\Applications\Altium\Datasheets\SW_TYCO_1571983-4.pdf; Author: CERN DEM JLC; CreateDate: 1/8/2009; LatestRevisionDate: 1/8/2009
TP5-TP8 = NICOMATIC_C12000B: Part Description: SMD Test Point; Table: Miscellaneous; Part Number: NICOMATIC_C12000B; Component Kind: Standard; Component Type: Standard; Pin Count: 1; Family: Test Point; Mounted: Yes; Socket: No; SMD: Yes; Status: None; Manufacturer: NICOMATIC; Manufacturer Part Number: C12000B; ComponentHeight: 1.5mm; HelpURL: \\cern.ch\dfs\Applications\Altium\Datasheets\NICOMATIC_C12000B.pdf; Author: CERN DEM JLC; CreateDate: 3/25/2009; LatestRevisionDate: 3/25/2009
TR1 = XFMR_MINI-CIRCUITS_T1-6T-KK81: 50 Ohm 0.015 To 300MHz RF Transformers; Part Description: 50 Ohms 0.015 To 300MHz RF Transformers; Part Number: XFMR_MINI-CIRCUITS_T1-6T-KK81; Component Kind: Standard; Component Type: Standard; Pin Count: 5; Value: 1:1; Status: None; Manufacturer: MINI-CIRCUITS; Manufacturer Part Number: T1-6T-KK81; Mounted: Yes; Socket: No; SMD: Yes; ComponentHeight: 6.6mm; Author: S. Jafar; CreateDate: 12/22/2015; LatestRevisionDate: 1/10/2016; Table: Transformers